# EAGLE schematic allModules (EAGLE 9.6.2)

## Sheet 1 of 7: MAIN MODULE
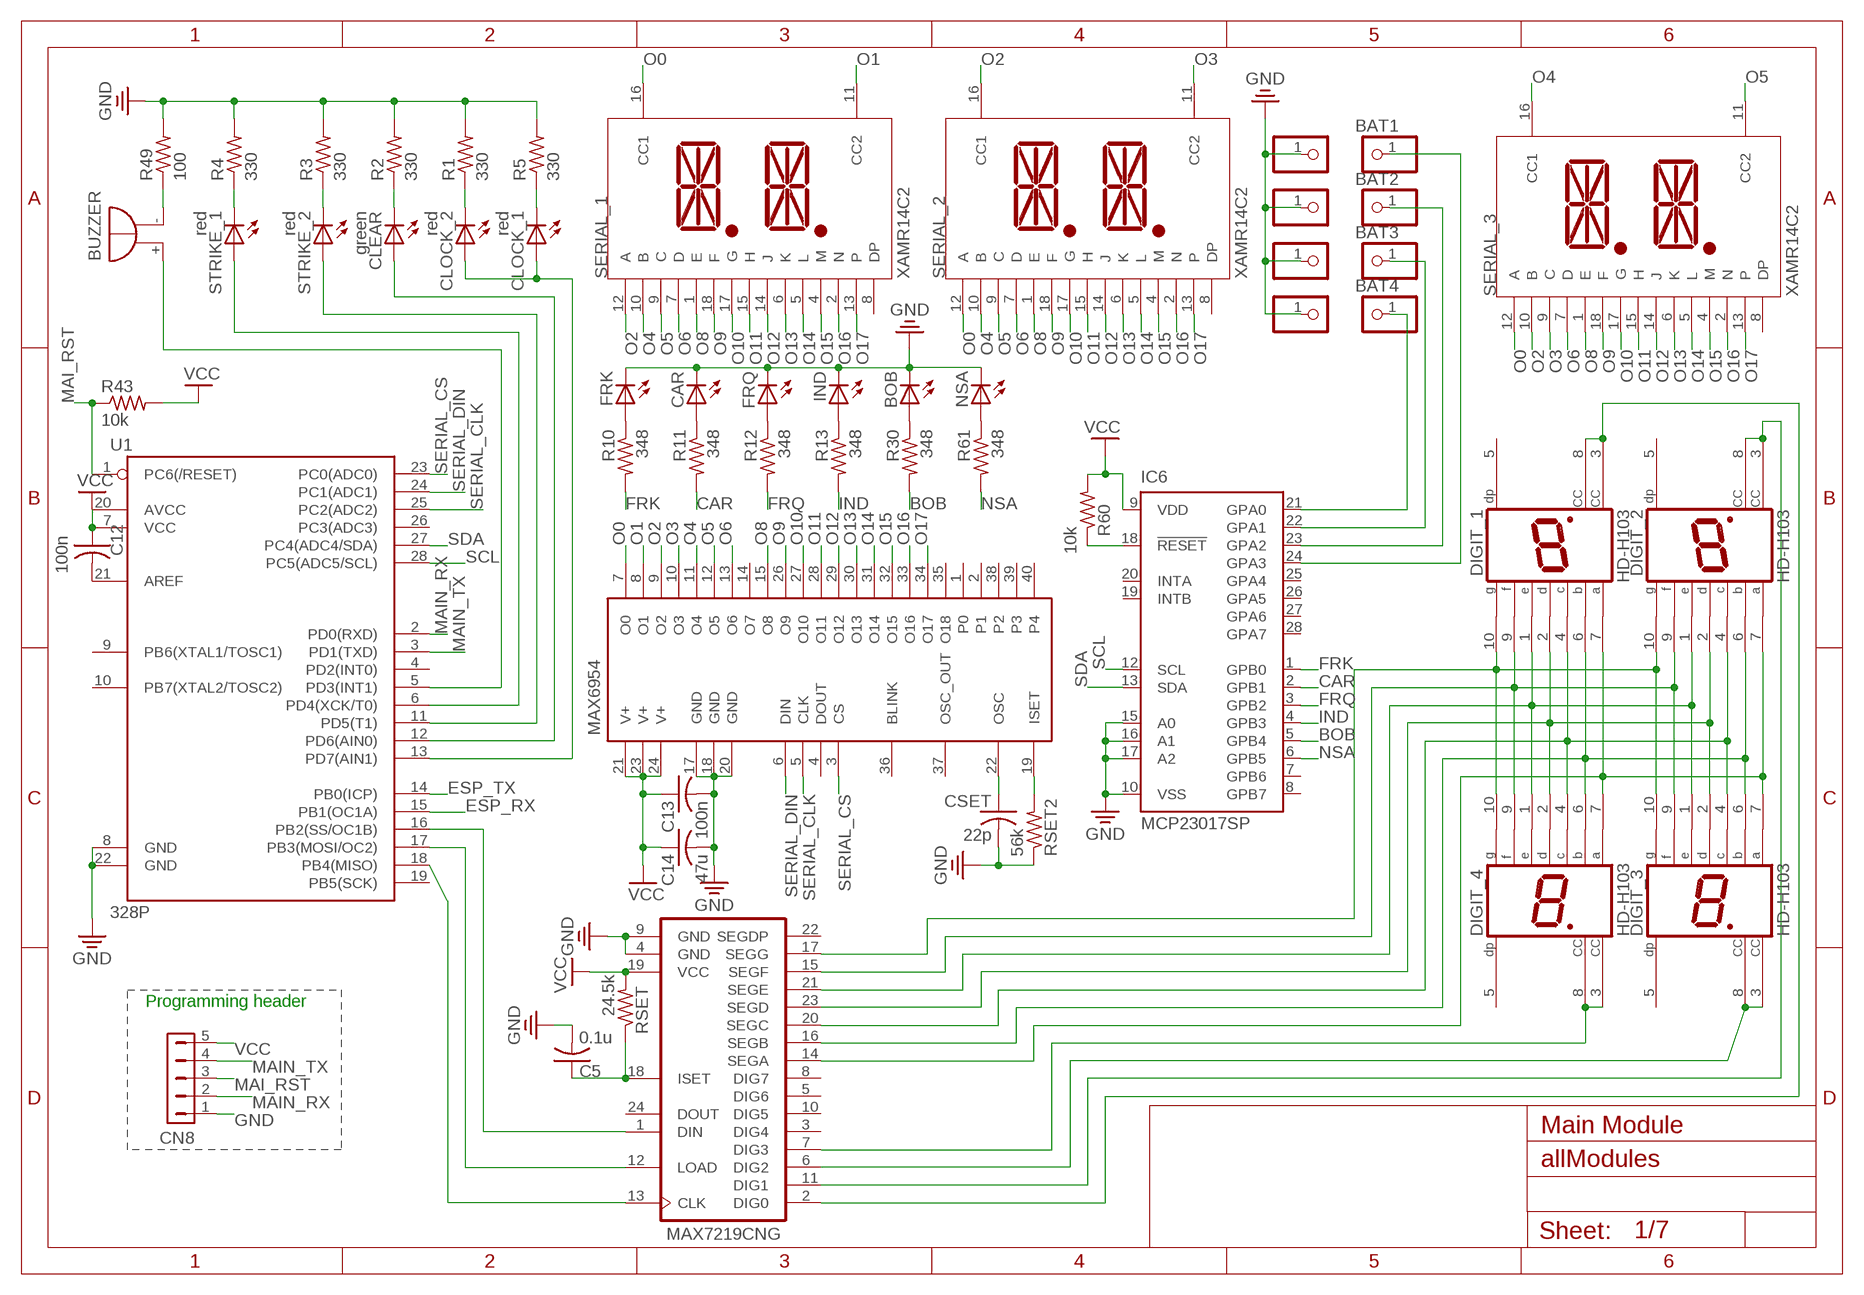
[diagram p0: schematic, sheet 1]

### Parts
BAT1  PINHD-1X1  [1X01]
BAT2  PINHD-1X1  [1X01]
BAT3  PINHD-1X1  [1X01]
BAT4  PINHD-1X1  [1X01]
BOB  LED5MM  [LED5MM]
BUZZER  EB2209A  [EB2209A]
C5  0.1u  C-US025-024X044  [C025-024X044]
C12  100n  C-US025-024X044  [C025-024X044]
C13  100n  C-US025-024X044  [C025-024X044]
C14  47u  C-US025-024X044  [C025-024X044]
CAR  LED5MM  [LED5MM]
CLEAR  green  LED5MM  [LED5MM]
CLOCK_1  red  LED5MM  [LED5MM]
CLOCK_2  red  LED5MM  [LED5MM]
CN8  HDR-1X5-SIP-100  [SIP-100-5V]
CSET  22p  C-US025-024X044  [C025-024X044]
DIGIT_1  HD-H103  [HDSP-M]
DIGIT_2  HD-H103  [HDSP-M]
DIGIT_3  HD-H103  [HDSP-M]
DIGIT_4  HD-H103  [HDSP-M]
FRK  LED5MM  [LED5MM]
FRQ  LED5MM  [LED5MM]
IC1  MAX7219CNG  [DIL24-3]
IC6  MCP23017SP  [DIL28-3]
IND  LED5MM  [LED5MM]
JP17  PINHD-1X1  [1X01]
JP18  PINHD-1X1  [1X01]
JP19  PINHD-1X1  [1X01]
JP20  PINHD-1X1  [1X01]
MAX6954  MAX6954  [MAX6954]
NSA  LED5MM  [LED5MM]
R1  330  R-US_0309/12  [0309/12]
R2  330  R-US_0309/12  [0309/12]
R3  330  R-US_0309/12  [0309/12]
R4  330  R-US_0309/12  [0309/12]
R5  330  R-US_0309/12  [0309/12]
R10  348  R-US_0204/7  [0204/7]
R11  348  R-US_0204/7  [0204/7]
R12  348  R-US_0204/7  [0204/7]
R13  348  R-US_0204/7  [0204/7]
R30  348  R-US_0204/7  [0204/7]
R43  10k  R-US_0309/12  [0309/12]
R49  100  R-US_0309/12  [0309/12]
R60  10k  R-US_0204/7  [0204/7]
R61  348  R-US_0204/7  [0204/7]
RSET  24.5k  R-US_0204/7  [0204/7]
RSET2  56k  R-US_0204/7  [0204/7]
SERIAL_1  XAMR14C2  [XAMR14C2]
SERIAL_2  XAMR14C2  [XAMR14C2]
SERIAL_3  XAMR14C2  [XAMR14C2]
STRIKE_1  red  LED5MM  [LED5MM]
STRIKE_2  red  LED5MM  [LED5MM]
U1  328P  ATMEGA328P_PDIP  [DIP28]

### Nets
BAT1: BAT1.1 IC6.24(GPA3)
BOB: IC6.5(GPB4) R30.2
CAR: IC6.2(GPB1) R11.2
ESP_RX: U1.15(PB1(OC1A)) ; also sheet 2
ESP_TX: U1.14(PB0(ICP)) ; also sheet 2
FRK: IC6.1(GPB0) R10.2
FRQ: IC6.3(GPB2) R12.2
GND: BOB.K(C) C5.2 C13.2 C14.2 CAR.K(C) CN8.1 CSET.2 FRK.K(C) FRQ.K(C) IC1.4(GND) IC1.9(GND) IC6.10(VSS) IC6.15(A0) IC6.16(A1) IC6.17(A2) IND.K(C) JP17.1 JP18.1 JP19.1 JP20.1 MAX6954.17(GND) MAX6954.18(GND) MAX6954.20(GND) NSA.K(C) R1.2 R2.2 R3.2 R4.2 R5.2 R49.2 RSET2.1 U1.8(GND) U1.22(GND) ; also sheet 3,4,5,6,7
IND: IC6.4(GPB3) R13.2
MAI_RST: CN8.3 R43.1 U1.1(PC6(/RESET))
MAIN_RX: CN8.2 U1.2(PD0(RXD))
MAIN_TX: CN8.4 U1.3(PD1(TXD))
N$1: DIGIT_1.7(A) DIGIT_2.7(A) DIGIT_3.7(A) DIGIT_4.7(A) IC1.14(SEGA)
N$2: DIGIT_1.6(B) DIGIT_2.6(B) DIGIT_3.6(B) DIGIT_4.6(B) IC1.16(SEGB)
N$3: DIGIT_1.4(C) DIGIT_2.4(C) DIGIT_3.4(C) DIGIT_4.4(C) IC1.20(SEGC)
N$4: DIGIT_1.2(D) DIGIT_2.2(D) DIGIT_3.2(D) DIGIT_4.2(D) IC1.23(SEGD)
N$5: DIGIT_1.1(E) DIGIT_2.1(E) DIGIT_3.1(E) DIGIT_4.1(E) IC1.21(SEGE)
N$6: DIGIT_1.9(F) DIGIT_2.9(F) DIGIT_3.9(F) DIGIT_4.9(F) IC1.15(SEGF)
N$7: DIGIT_1.10(G) DIGIT_2.10(G) DIGIT_3.10(G) DIGIT_4.10(G) IC1.17(SEGG)
N$8: CSET.1 MAX6954.22(OSC)
N$9: MAX6954.19(ISET) RSET2.2
N$10: IC1.12(LOAD) U1.17(PB3(MOSI/OC2))
N$11: IC1.1(DIN) U1.16(PB2(SS/OC1B))
N$12: IC1.13(CLK) U1.18(PB4(MISO))
N$13: DIGIT_2.3(CC) DIGIT_2.8(CC) IC1.11(DIG1)
N$14: DIGIT_1.3(CC) DIGIT_1.8(CC) IC1.2(DIG0)
N$15: BUZZER.- R49.1
N$18: DIGIT_3.3(CC) DIGIT_3.8(CC) IC1.6(DIG2)
N$19: DIGIT_4.3(CC) DIGIT_4.8(CC) IC1.7(DIG3)
N$22: R4.1 STRIKE_1.K(C)
N$23: R3.1 STRIKE_2.K(C)
N$24: CLEAR.K(C) R2.1
N$25: CLOCK_2.K(C) R1.1
N$26: CLOCK_1.K(C) R5.1
N$28: STRIKE_1.A U1.6(PD4(XCK/T0))
N$29: STRIKE_2.A U1.11(PD5(T1))
N$30: CLEAR.A U1.12(PD6(AIN0))
N$31: CLOCK_1.A CLOCK_2.A U1.13(PD7(AIN1))
N$73: C5.1 IC1.18(ISET) RSET.1
N$108: IC6.18(!RESET) R60.1
N$115: BUZZER.+ U1.5(PD3(INT1))
N$127: FRK.A R10.1
N$128: BAT2.1 IC6.23(GPA2)
N$140: C12.2 U1.21(AREF)
N$141: BAT3.1 IC6.22(GPA1)
N$142: BAT4.1 IC6.21(GPA0)
N$143: CAR.A R11.1
N$146: FRQ.A R12.1
N$147: IND.A R13.1
N$148: BOB.A R30.1
N$151: NSA.A R61.1
NSA: IC6.6(GPB5) R61.2
O0: MAX6954.7(O0) SERIAL_1.16(CC1) SERIAL_2.12(A) SERIAL_3.12(A)
O1: MAX6954.8(O1) SERIAL_1.11(CC2)
O2: MAX6954.9(O2) SERIAL_1.12(A) SERIAL_2.16(CC1) SERIAL_3.10(B)
O3: MAX6954.10(O3) SERIAL_2.11(CC2) SERIAL_3.9(C)
O4: MAX6954.11(O4) SERIAL_1.10(B) SERIAL_2.10(B) SERIAL_3.16(CC1)
O5: MAX6954.12(O5) SERIAL_1.9(C) SERIAL_2.9(C) SERIAL_3.11(CC2)
O6: MAX6954.13(O6) SERIAL_1.7(D) SERIAL_2.7(D) SERIAL_3.7(D)
O8: MAX6954.15(O8) SERIAL_1.1(E) SERIAL_2.1(E) SERIAL_3.1(E)
O9: MAX6954.26(O9) SERIAL_1.18(F) SERIAL_2.18(F) SERIAL_3.18(F)
O10: MAX6954.27(O10) SERIAL_1.17(G) SERIAL_2.17(G) SERIAL_3.17(G)
O11: MAX6954.28(O11) SERIAL_1.15(H) SERIAL_2.15(H) SERIAL_3.15(H)
O12: MAX6954.29(O12) SERIAL_1.14(J) SERIAL_2.14(J) SERIAL_3.14(J)
O13: MAX6954.30(O13) SERIAL_1.6(K) SERIAL_2.6(K) SERIAL_3.6(K)
O14: MAX6954.31(O14) SERIAL_1.5(L) SERIAL_2.5(L) SERIAL_3.5(L)
O15: MAX6954.32(O15) SERIAL_1.4(M) SERIAL_2.4(M) SERIAL_3.4(M)
O16: MAX6954.33(O16) SERIAL_1.2(N) SERIAL_2.2(N) SERIAL_3.2(N)
O17: MAX6954.34(O17) SERIAL_1.13(P) SERIAL_2.13(P) SERIAL_3.13(P)
SCL: IC6.12(SCL) U1.28(PC5(ADC5/SCL)) ; also sheet 3,4,5,6,7
SDA: IC6.13(SDA) U1.27(PC4(ADC4/SDA)) ; also sheet 3,4,5,6,7
SERIAL_CLK: MAX6954.5(CLK) U1.25(PC2(ADC2))
SERIAL_CS: MAX6954.3(CS) U1.23(PC0(ADC0))
SERIAL_DIN: MAX6954.6(DIN) U1.24(PC1(ADC1))
VCC: C12.1 C13.1 C14.1 CN8.5 IC1.19(VCC) IC6.9(VDD) MAX6954.21(V+) MAX6954.23(V+) MAX6954.24(V+) R43.2 R60.2 RSET.2 U1.7(VCC) U1.20(AVCC) ; also sheet 3,4,5,6,7
Unconnected: DIGIT_1.5(DP) DIGIT_2.5(DP) DIGIT_3.5(DP) DIGIT_4.5(DP) IC1.3(DIG4) IC1.5(DIG6) IC1.8(DIG7) IC1.10(DIG5) IC1.22(SEGDP) IC1.24(DOUT) IC6.7(GPB6) IC6.8(GPB7) IC6.19(INTB) IC6.20(INTA) IC6.25(GPA4) IC6.26(GPA5) IC6.27(GPA6) IC6.28(GPA7) MAX6954.1(P0) MAX6954.2(P1) MAX6954.4(DOUT) MAX6954.14(O7) MAX6954.35(O18) MAX6954.36(BLINK) MAX6954.37(OSC_OUT) MAX6954.38(P2) MAX6954.39(P3) MAX6954.40(P4) SERIAL_1.8(DP) SERIAL_2.8(DP) SERIAL_3.8(DP) U1.4(PD2(INT0)) U1.9(PB6(XTAL1/TOSC1)) U1.10(PB7(XTAL2/TOSC2)) U1.19(PB5(SCK)) U1.26(PC3(ADC3))

### Notes on the sheet
- Programming header
- Main Module

## Sheet 2 of 7: CONFIG MODULE
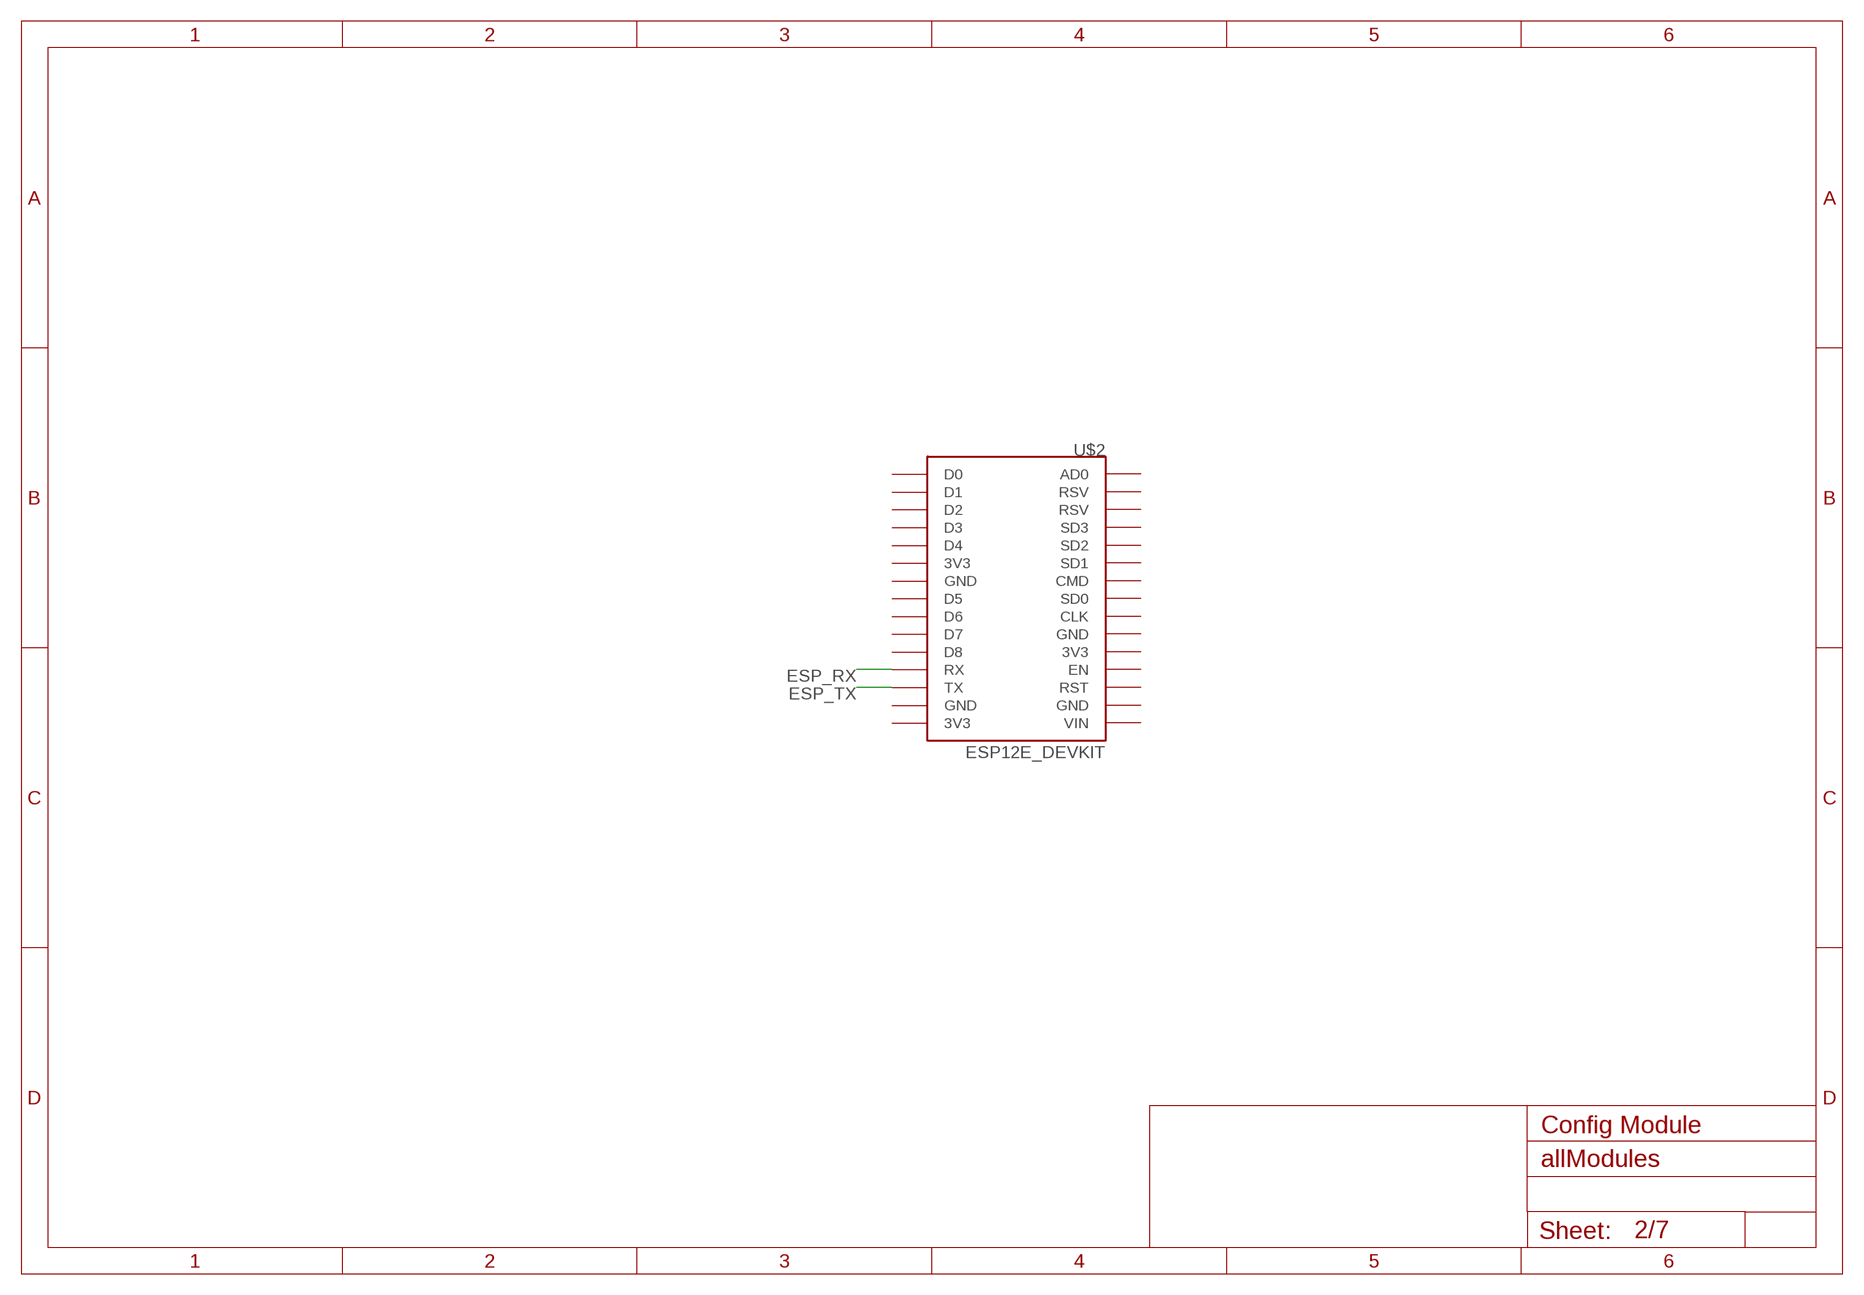
[diagram p1: schematic, sheet 2]

### Parts
U$2  ESP12E_DEVKIT  [ESP12E_DEVKIT]

### Nets
ESP_RX: U$2.RX ; also sheet 1
ESP_TX: U$2.TX ; also sheet 1
Unconnected: U$2.3V3@0(3V3) U$2.3V3@1(3V3) U$2.3V3@2(3V3) U$2.AD0 U$2.CLK U$2.CMD U$2.D0 U$2.D1 U$2.D2 U$2.D3 U$2.D4 U$2.D5 U$2.D6 U$2.D7 U$2.D8 U$2.EN U$2.GND@0(GND) U$2.GND@1(GND) U$2.GND@2(GND) U$2.GND@3(GND) U$2.RST U$2.RSV@0(RSV) U$2.RSV@1(RSV) U$2.SD0 U$2.SD1 U$2.SD2 U$2.SD3 U$2.VIN

### Notes on the sheet
- Config Module

## Sheet 3 of 7: SIMON SAYS
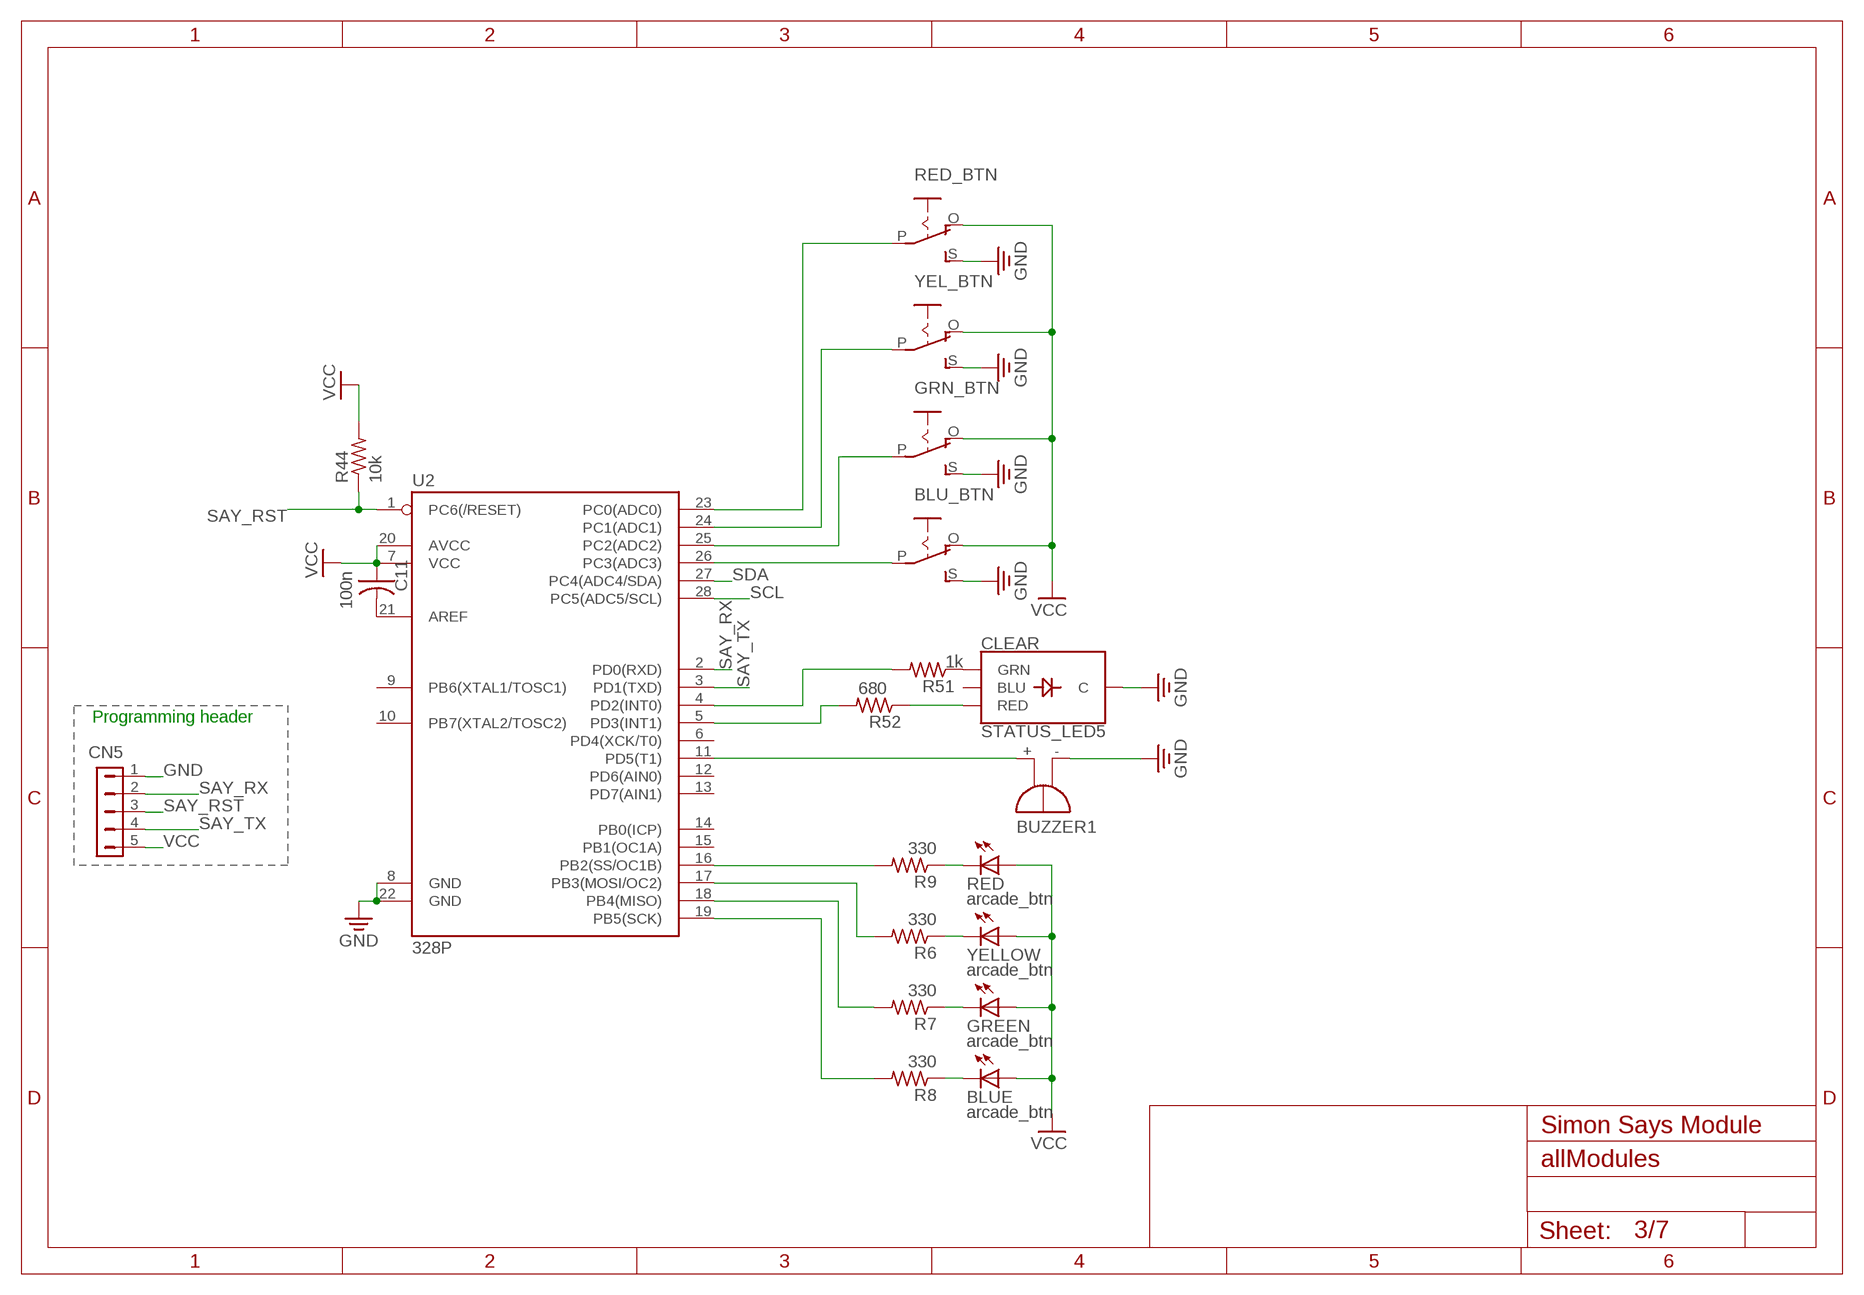
[diagram p2: schematic, sheet 3]

### Parts
BLU_BTN  EG1218S  [EG1218]
BLUE  arcade_btn  LED5MM  [LED5MM]
BUZZER1  EB2209A  [EB2209A]
C11  100n  C-US025-024X044  [C025-024X044]
CN5  HDR-1X5-SIP-100  [SIP-100-5V]
GREEN  arcade_btn  LED5MM  [LED5MM]
GRN_BTN  EG1218S  [EG1218]
R6  330  R-US_0309/12  [0309/12]
R7  330  R-US_0309/12  [0309/12]
R8  330  R-US_0309/12  [0309/12]
R9  330  R-US_0309/12  [0309/12]
R44  10k  R-US_0309/12  [0309/12]
R51  1k  FLIPFLOP-RES  [0805-THM]
R52  680  FLIPFLOP-RES  [0805-THM]
RED  arcade_btn  LED5MM  [LED5MM]
RED_BTN  EG1218S  [EG1218]
STATUS_LED5  CLEAR  LED-RGB-CCCLEAR  [LED-RGB-THRU]
U2  328P  ATMEGA328P_PDIP  [DIP28]
YEL_BTN  EG1218S  [EG1218]
YELLOW  arcade_btn  LED5MM  [LED5MM]

### Nets
GND: BLU_BTN.S BUZZER1.- CN5.1 GRN_BTN.S RED_BTN.S STATUS_LED5.2(C) U2.8(GND) U2.22(GND) YEL_BTN.S ; also sheet 1,4,5,6,7
N$33: BUZZER1.+ U2.11(PD5(T1))
N$34: BLU_BTN.P U2.26(PC3(ADC3))
N$35: GRN_BTN.P U2.25(PC2(ADC2))
N$38: U2.24(PC1(ADC1)) YEL_BTN.P
N$39: RED_BTN.P U2.23(PC0(ADC0))
N$43: R6.2 U2.17(PB3(MOSI/OC2))
N$44: BLUE.K(C) R8.1
N$45: GREEN.K(C) R7.1
N$46: R6.1 YELLOW.K(C)
N$47: R9.1 RED.K(C)
N$48: R7.2 R8.2 U2.18(PB4(MISO)) U2.19(PB5(SCK))
N$70: R52.2 U2.5(PD3(INT1))
N$71: R51.2 U2.4(PD2(INT0))
N$116: R9.2 U2.16(PB2(SS/OC1B))
N$139: C11.2 U2.21(AREF)
N$144: R51.1 STATUS_LED5.3(GRN)
N$145: R52.1 STATUS_LED5.1(RED)
SAY_RST: CN5.3 R44.1 U2.1(PC6(/RESET))
SAY_RX: CN5.2 U2.2(PD0(RXD))
SAY_TX: CN5.4 U2.3(PD1(TXD))
SCL: U2.28(PC5(ADC5/SCL)) ; also sheet 1,4,5,6,7
SDA: U2.27(PC4(ADC4/SDA)) ; also sheet 1,4,5,6,7
VCC: BLU_BTN.O BLUE.A C11.1 CN5.5 GREEN.A GRN_BTN.O R44.2 RED.A RED_BTN.O U2.7(VCC) U2.20(AVCC) YEL_BTN.O YELLOW.A ; also sheet 1,4,5,6,7
Unconnected: STATUS_LED5.4(BLU) U2.6(PD4(XCK/T0)) U2.9(PB6(XTAL1/TOSC1)) U2.10(PB7(XTAL2/TOSC2)) U2.12(PD6(AIN0)) U2.13(PD7(AIN1)) U2.14(PB0(ICP)) U2.15(PB1(OC1A))

### Notes on the sheet
- Programming header
- Simon Says Module

## Sheet 4 of 7: MAZE
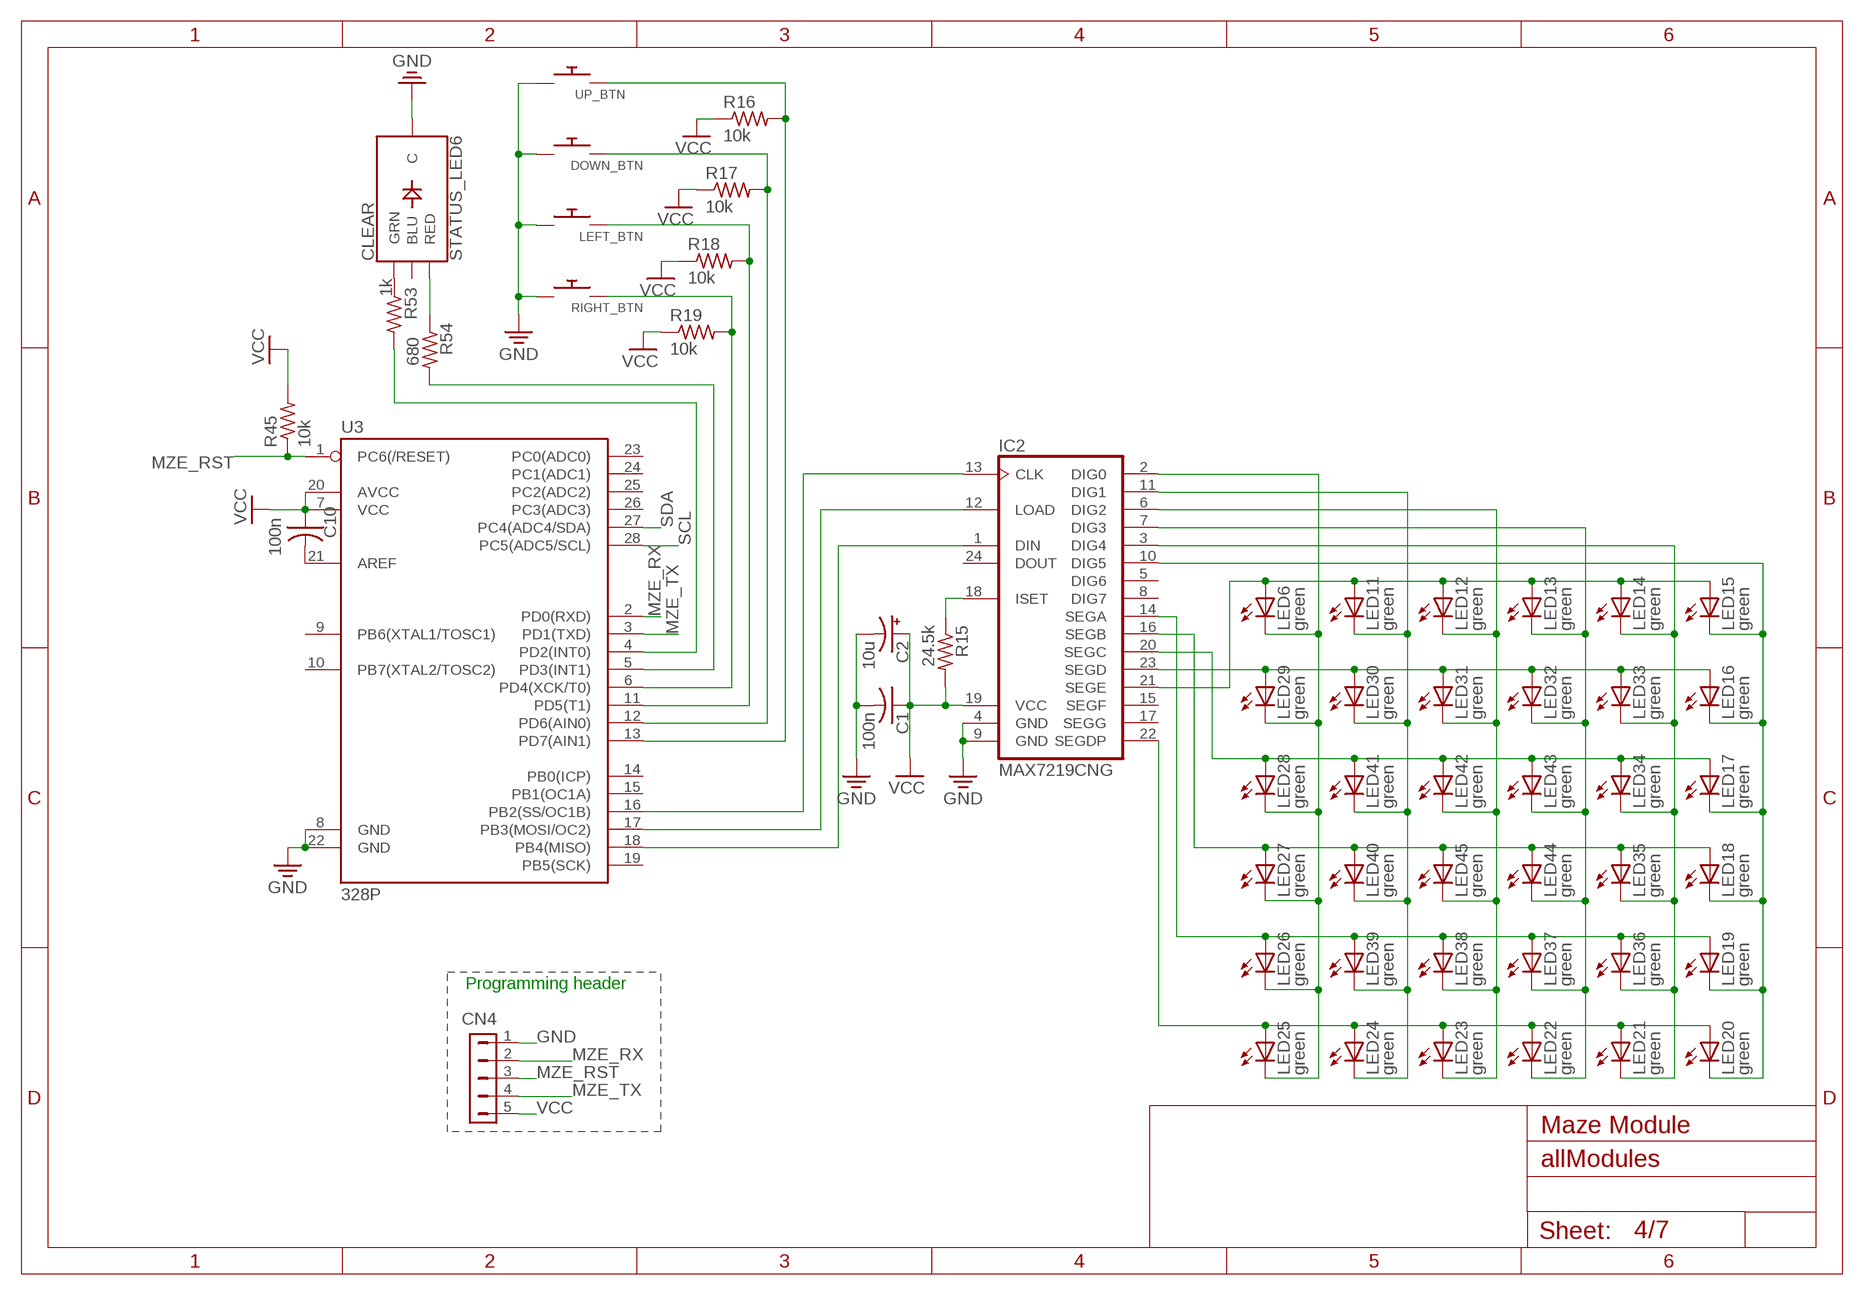
[diagram p3: schematic, sheet 4]

### Parts
C1  100n  C-US025-024X044  [C025-024X044]
C2  10u  CPOL-US085CS-1AR  [085CS_1AR]
C10  100n  C-US025-024X044  [C025-024X044]
CN4  HDR-1X5-SIP-100  [SIP-100-5V]
DOWN_BTN  SWITCH_PUSHBUTTONEVQ-PE  [TACT_PANA-EVQ]
IC2  MAX7219CNG  [DIL24-3]
LED6  green  LED5MM  [LED5MM]
LED11  green  LED5MM  [LED5MM]
LED12  green  LED5MM  [LED5MM]
LED13  green  LED5MM  [LED5MM]
LED14  green  LED5MM  [LED5MM]
LED15  green  LED5MM  [LED5MM]
LED16  green  LED5MM  [LED5MM]
LED17  green  LED5MM  [LED5MM]
LED18  green  LED5MM  [LED5MM]
LED19  green  LED5MM  [LED5MM]
LED20  green  LED5MM  [LED5MM]
LED21  green  LED5MM  [LED5MM]
LED22  green  LED5MM  [LED5MM]
LED23  green  LED5MM  [LED5MM]
LED24  green  LED5MM  [LED5MM]
LED25  green  LED5MM  [LED5MM]
LED26  green  LED5MM  [LED5MM]
LED27  green  LED5MM  [LED5MM]
LED28  green  LED5MM  [LED5MM]
LED29  green  LED5MM  [LED5MM]
LED30  green  LED5MM  [LED5MM]
LED31  green  LED5MM  [LED5MM]
LED32  green  LED5MM  [LED5MM]
LED33  green  LED5MM  [LED5MM]
LED34  green  LED5MM  [LED5MM]
LED35  green  LED5MM  [LED5MM]
LED36  green  LED5MM  [LED5MM]
LED37  green  LED5MM  [LED5MM]
LED38  green  LED5MM  [LED5MM]
LED39  green  LED5MM  [LED5MM]
LED40  green  LED5MM  [LED5MM]
LED41  green  LED5MM  [LED5MM]
LED42  green  LED5MM  [LED5MM]
LED43  green  LED5MM  [LED5MM]
LED44  green  LED5MM  [LED5MM]
LED45  green  LED5MM  [LED5MM]
LEFT_BTN  SWITCH_PUSHBUTTONEVQ-PE  [TACT_PANA-EVQ]
R15  24.5k  R-US_0309/12  [0309/12]
R16  10k  R-US_0309/12  [0309/12]
R17  10k  R-US_0309/12  [0309/12]
R18  10k  R-US_0309/12  [0309/12]
R19  10k  R-US_0309/12  [0309/12]
R45  10k  R-US_0309/12  [0309/12]
R53  1k  FLIPFLOP-RES  [0805-THM]
R54  680  FLIPFLOP-RES  [0805-THM]
RIGHT_BTN  SWITCH_PUSHBUTTONEVQ-PE  [TACT_PANA-EVQ]
STATUS_LED6  CLEAR  LED-RGB-CCCLEAR  [LED-RGB-THRU]
U3  328P  ATMEGA328P_PDIP  [DIP28]
UP_BTN  SWITCH_PUSHBUTTONEVQ-PE  [TACT_PANA-EVQ]

### Nets
GND: C1.2 C2.- CN4.1 DOWN_BTN.P$1 IC2.4(GND) IC2.9(GND) LEFT_BTN.P$1 RIGHT_BTN.P$1 STATUS_LED6.2(C) U3.8(GND) U3.22(GND) UP_BTN.P$1 ; also sheet 1,3,5,6,7
MZE_RST: CN4.3 R45.1 U3.1(PC6(/RESET))
MZE_RX: CN4.2 U3.2(PD0(RXD))
MZE_TX: CN4.4 U3.3(PD1(TXD))
N$36: IC2.22(SEGDP) LED20.A LED21.A LED22.A LED23.A LED24.A LED25.A
N$40: IC2.14(SEGA) LED19.A LED26.A LED36.A LED37.A LED38.A LED39.A
N$41: IC2.16(SEGB) LED18.A LED27.A LED35.A LED40.A LED44.A LED45.A
N$42: IC2.20(SEGC) LED17.A LED28.A LED34.A LED41.A LED42.A LED43.A
N$49: IC2.2(DIG0) LED6.K(C) LED25.K(C) LED26.K(C) LED27.K(C) LED28.K(C) LED29.K(C)
N$50: IC2.21(SEGE) LED11.A LED12.A LED13.A LED14.A LED15.A
N$52: IC2.23(SEGD) LED16.A LED29.A LED30.A LED31.A LED32.A LED33.A
N$53: R16.2 U3.13(PD7(AIN1)) UP_BTN.P$2
N$54: IC2.11(DIG1) LED11.K(C) LED24.K(C) LED30.K(C) LED39.K(C) LED40.K(C) LED41.K(C)
N$55: IC2.6(DIG2) LED12.K(C) LED23.K(C) LED31.K(C) LED38.K(C) LED42.K(C) LED45.K(C)
N$56: IC2.7(DIG3) LED13.K(C) LED22.K(C) LED32.K(C) LED37.K(C) LED43.K(C) LED44.K(C)
N$57: IC2.3(DIG4) LED14.K(C) LED21.K(C) LED33.K(C) LED34.K(C) LED35.K(C) LED36.K(C)
N$58: IC2.10(DIG5) LED15.K(C) LED16.K(C) LED17.K(C) LED18.K(C) LED19.K(C) LED20.K(C)
N$59: DOWN_BTN.P$2 R17.2 U3.12(PD6(AIN0))
N$60: LEFT_BTN.P$2 R18.2 U3.11(PD5(T1))
N$61: IC2.18(ISET) R15.1
N$62: R19.2 RIGHT_BTN.P$2 U3.6(PD4(XCK/T0))
N$63: IC2.1(DIN) U3.18(PB4(MISO))
N$64: IC2.13(CLK) U3.16(PB2(SS/OC1B))
N$65: IC2.12(LOAD) U3.17(PB3(MOSI/OC2))
N$67: R54.2 U3.5(PD3(INT1))
N$68: R53.2 U3.4(PD2(INT0))
N$138: C10.2 U3.21(AREF)
N$149: R53.1 STATUS_LED6.3(GRN)
N$150: R54.1 STATUS_LED6.1(RED)
SCL: U3.28(PC5(ADC5/SCL)) ; also sheet 1,3,5,6,7
SDA: U3.27(PC4(ADC4/SDA)) ; also sheet 1,3,5,6,7
VCC: C1.1 C2.+ C10.1 CN4.5 IC2.19(VCC) R15.2 R16.1 R17.1 R18.1 R19.1 R45.2 U3.7(VCC) U3.20(AVCC) ; also sheet 1,3,5,6,7
VCC2: LED6.A
Unconnected: IC2.5(DIG6) IC2.8(DIG7) IC2.15(SEGF) IC2.17(SEGG) IC2.24(DOUT) STATUS_LED6.4(BLU) U3.9(PB6(XTAL1/TOSC1)) U3.10(PB7(XTAL2/TOSC2)) U3.14(PB0(ICP)) U3.15(PB1(OC1A)) U3.19(PB5(SCK)) U3.23(PC0(ADC0)) U3.24(PC1(ADC1)) U3.25(PC2(ADC2)) U3.26(PC3(ADC3))

### Notes on the sheet
- Programming header
- Maze Module

## Sheet 5 of 7: SIMPLE WIRES
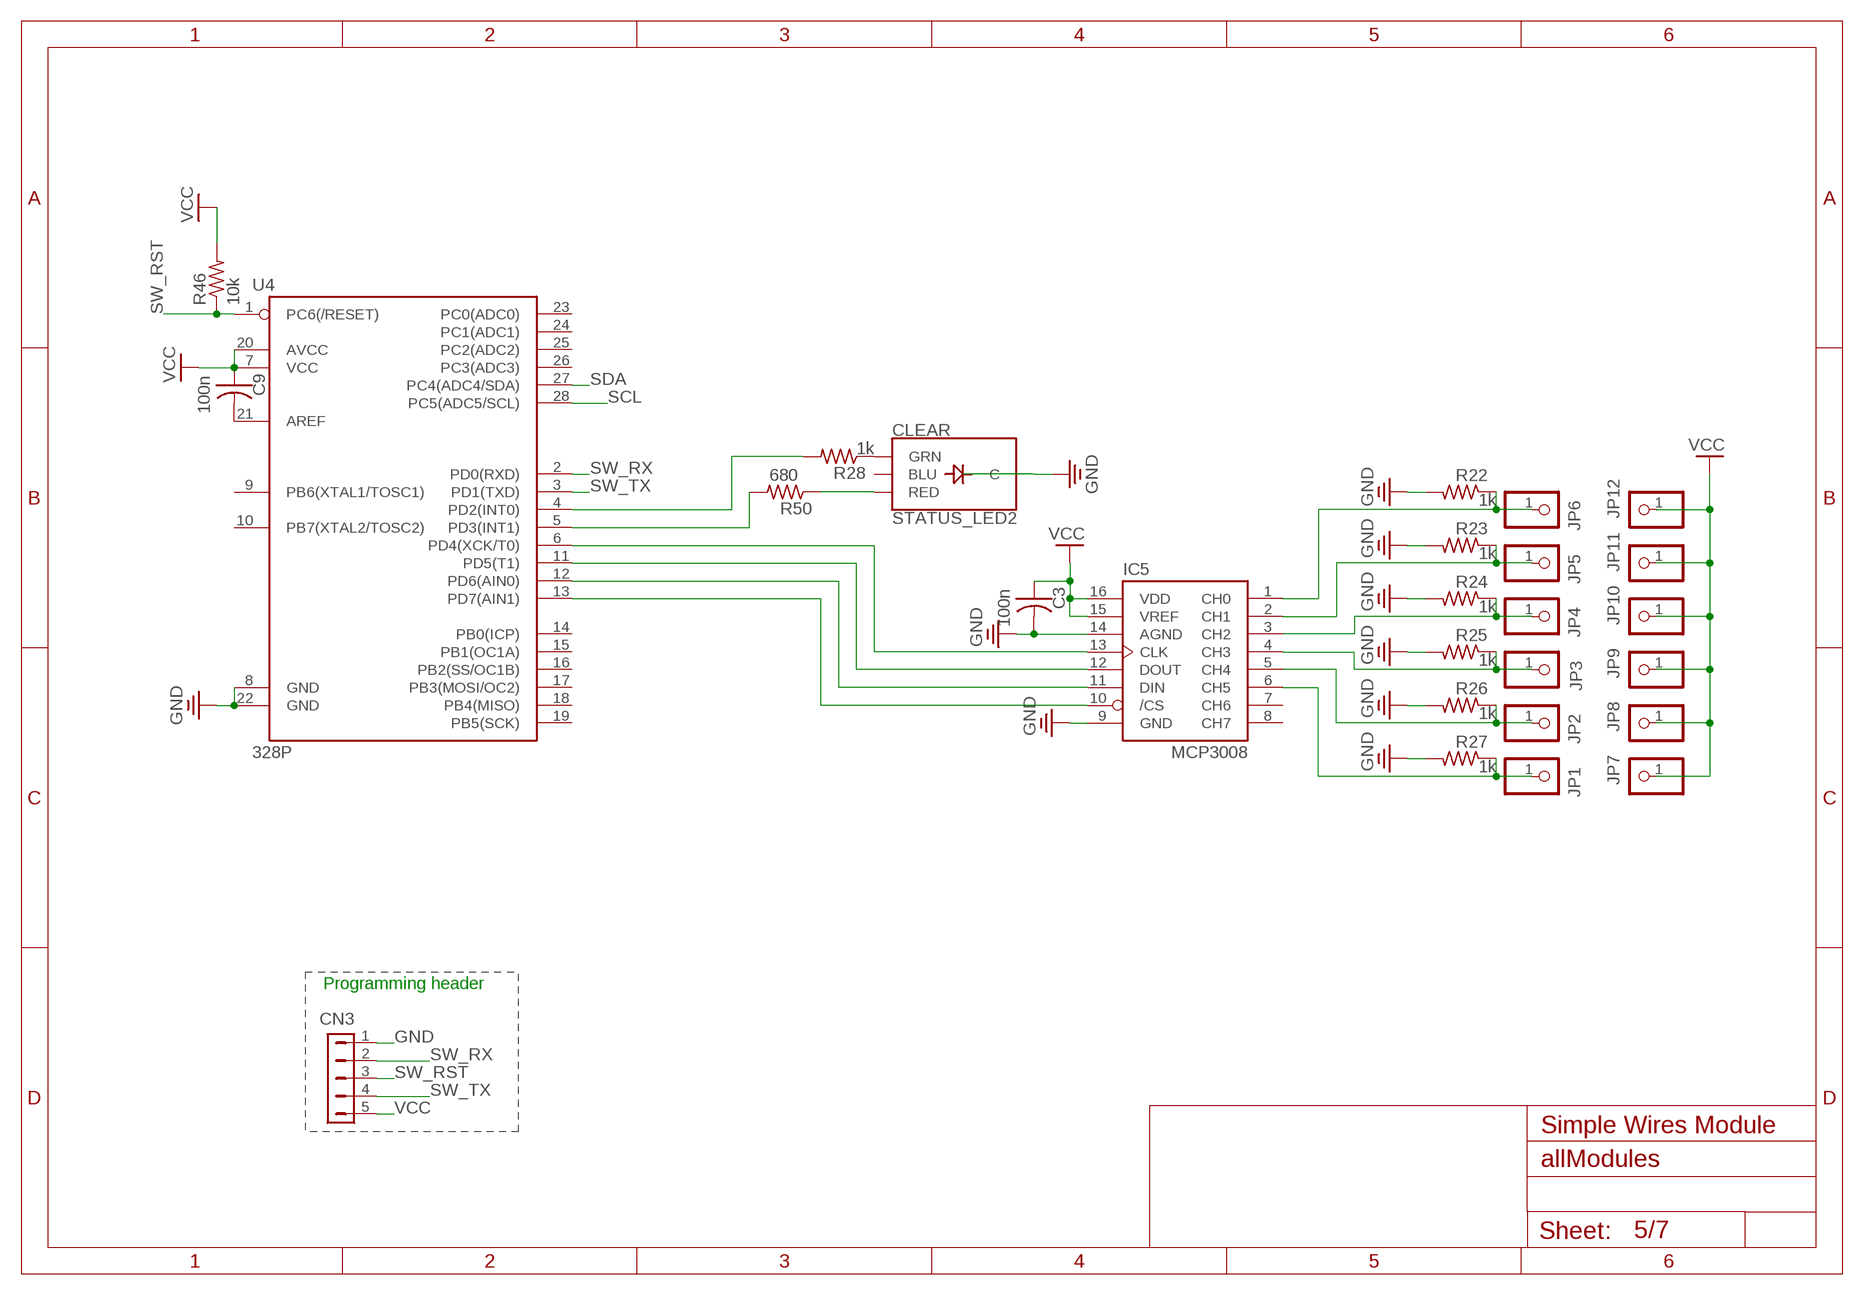
[diagram p4: schematic, sheet 5]

### Parts
C3  100n  C-US025-024X044  [C025-024X044]
C9  100n  C-US025-024X044  [C025-024X044]
CN3  HDR-1X5-SIP-100  [SIP-100-5V]
IC5  MCP3008  [DIL16]
JP1  PINHD-1X1  [1X01]
JP2  PINHD-1X1  [1X01]
JP3  PINHD-1X1  [1X01]
JP4  PINHD-1X1  [1X01]
JP5  PINHD-1X1  [1X01]
JP6  PINHD-1X1  [1X01]
JP7  PINHD-1X1  [1X01]
JP8  PINHD-1X1  [1X01]
JP9  PINHD-1X1  [1X01]
JP10  PINHD-1X1  [1X01]
JP11  PINHD-1X1  [1X01]
JP12  PINHD-1X1  [1X01]
R22  1k  FLIPFLOP-RES  [0805-THM]
R23  1k  FLIPFLOP-RES  [0805-THM]
R24  1k  FLIPFLOP-RES  [0805-THM]
R25  1k  FLIPFLOP-RES  [0805-THM]
R26  1k  FLIPFLOP-RES  [0805-THM]
R27  1k  FLIPFLOP-RES  [0805-THM]
R28  1k  FLIPFLOP-RES  [0805-THM]
R46  10k  R-US_0309/12  [0309/12]
R50  680  FLIPFLOP-RES  [0805-THM]
STATUS_LED2  CLEAR  LED-RGB-CCCLEAR  [LED-RGB-THRU]
U4  328P  ATMEGA328P_PDIP  [DIP28]

### Nets
GND: C3.2 CN3.1 IC5.9(GND) IC5.14(AGND) R22.2 R23.2 R24.2 R25.2 R26.2 R27.2 U4.8(GND) U4.22(GND) ; also sheet 1,3,4,6,7
N$16: R28.1 STATUS_LED2.3(GRN)
N$20: IC5.1(CH0) JP6.1 R22.1
N$21: STATUS_LED2.2(C) ; supply symbol labelled GND
N$27: IC5.6(CH5) JP1.1 R27.1
N$32: R50.1 STATUS_LED2.1(RED)
N$37: IC5.5(CH4) JP2.1 R26.1
N$51: IC5.4(CH3) JP3.1 R25.1
N$66: IC5.3(CH2) JP4.1 R24.1
N$74: IC5.2(CH1) JP5.1 R23.1
N$75: R28.2 U4.4(PD2(INT0))
N$76: R50.2 U4.5(PD3(INT1))
N$86: IC5.13(CLK) U4.6(PD4(XCK/T0))
N$87: IC5.12(DOUT) U4.11(PD5(T1))
N$88: IC5.11(DIN) U4.12(PD6(AIN0))
N$90: IC5.10(/CS) U4.13(PD7(AIN1))
N$124: C9.2 U4.21(AREF)
SCL: U4.28(PC5(ADC5/SCL)) ; also sheet 1,3,4,6,7
SDA: U4.27(PC4(ADC4/SDA)) ; also sheet 1,3,4,6,7
SW_RST: CN3.3 R46.1 U4.1(PC6(/RESET))
SW_RX: CN3.2 U4.2(PD0(RXD))
SW_TX: CN3.4 U4.3(PD1(TXD))
VCC: C3.1 C9.1 CN3.5 IC5.15(VREF) IC5.16(VDD) JP7.1 JP8.1 JP9.1 JP10.1 JP11.1 JP12.1 R46.2 U4.7(VCC) U4.20(AVCC) ; also sheet 1,3,4,6,7
Unconnected: IC5.7(CH6) IC5.8(CH7) STATUS_LED2.4(BLU) U4.9(PB6(XTAL1/TOSC1)) U4.10(PB7(XTAL2/TOSC2)) U4.14(PB0(ICP)) U4.15(PB1(OC1A)) U4.16(PB2(SS/OC1B)) U4.17(PB3(MOSI/OC2)) U4.18(PB4(MISO)) U4.19(PB5(SCK)) U4.23(PC0(ADC0)) U4.24(PC1(ADC1)) U4.25(PC2(ADC2)) U4.26(PC3(ADC3))

### Notes on the sheet
- Programming header
- Simple Wires Module

## Sheet 6 of 7: BUTTON
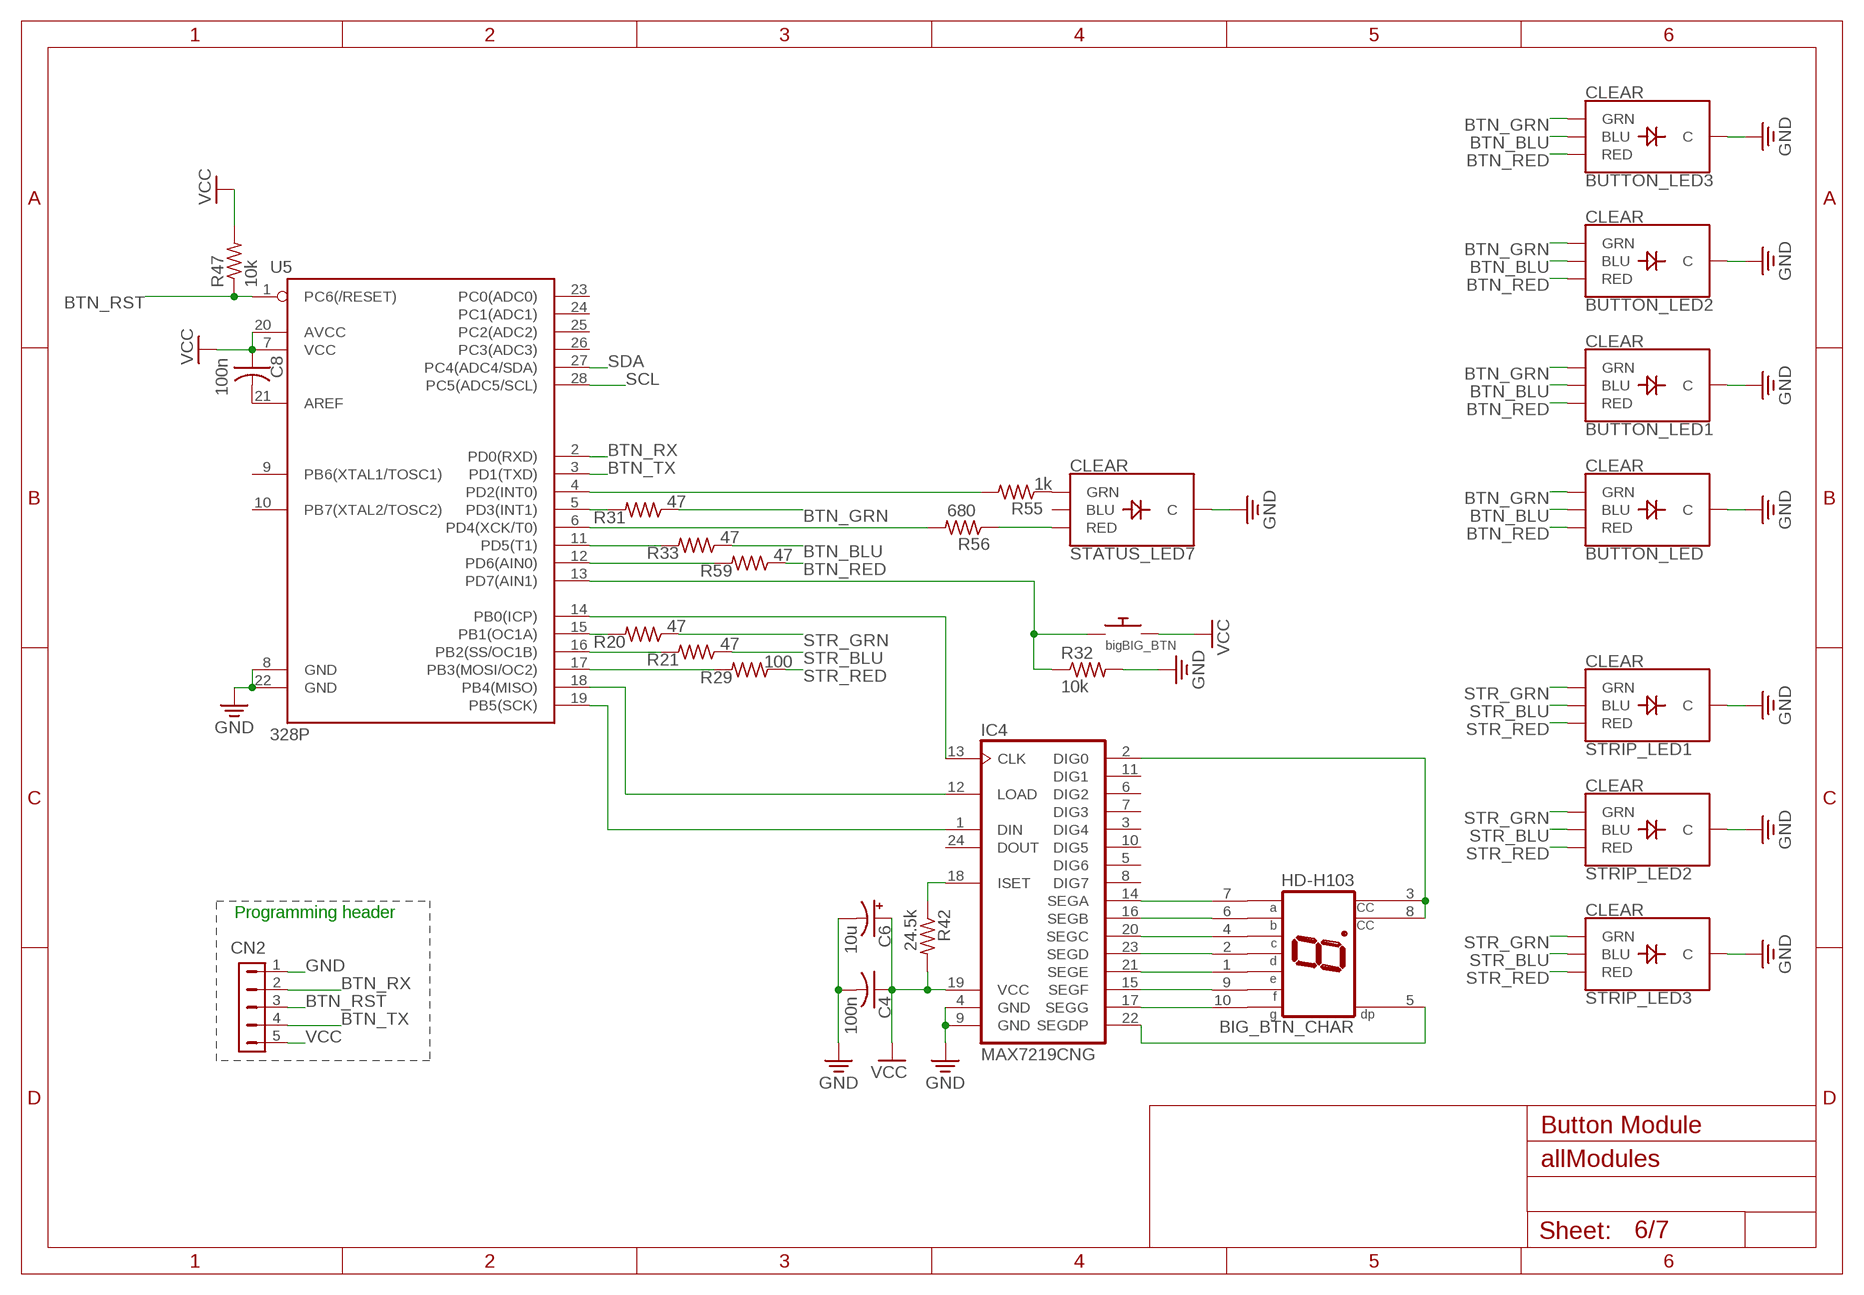
[diagram p5: schematic, sheet 6]

### Parts
BIG_BTN  big  SWITCH_PUSHBUTTONEVQ-PE  [TACT_PANA-EVQ]
BIG_BTN_CHAR  HD-H103  [HDSP-M]
BUTTON_LED  CLEAR  LED-RGB-CCCLEAR  [LED-RGB-THRU]
BUTTON_LED1  CLEAR  LED-RGB-CCCLEAR  [LED-RGB-THRU]
BUTTON_LED2  CLEAR  LED-RGB-CCCLEAR  [LED-RGB-THRU]
BUTTON_LED3  CLEAR  LED-RGB-CCCLEAR  [LED-RGB-THRU]
C4  100n  C-US025-024X044  [C025-024X044]
C6  10u  CPOL-US085CS-1AR  [085CS_1AR]
C8  100n  C-US025-024X044  [C025-024X044]
CN2  HDR-1X5-SIP-100  [SIP-100-5V]
IC4  MAX7219CNG  [DIL24-3]
R20  47  FLIPFLOP-RES  [0805-THM]
R21  47  FLIPFLOP-RES  [0805-THM]
R29  100  FLIPFLOP-RES  [0805-THM]
R31  47  FLIPFLOP-RES  [0805-THM]
R32  10k  R-US_0309/12  [0309/12]
R33  47  FLIPFLOP-RES  [0805-THM]
R42  24.5k  R-US_0309/12  [0309/12]
R47  10k  R-US_0309/12  [0309/12]
R55  1k  FLIPFLOP-RES  [0805-THM]
R56  680  FLIPFLOP-RES  [0805-THM]
R59  47  FLIPFLOP-RES  [0805-THM]
STATUS_LED7  CLEAR  LED-RGB-CCCLEAR  [LED-RGB-THRU]
STRIP_LED1  CLEAR  LED-RGB-CCCLEAR  [LED-RGB-THRU]
STRIP_LED2  CLEAR  LED-RGB-CCCLEAR  [LED-RGB-THRU]
STRIP_LED3  CLEAR  LED-RGB-CCCLEAR  [LED-RGB-THRU]
U5  328P  ATMEGA328P_PDIP  [DIP28]

### Nets
BTN_BLU: BUTTON_LED1.4(BLU) BUTTON_LED2.4(BLU) BUTTON_LED3.4(BLU) BUTTON_LED.4(BLU) R33.1
BTN_GRN: BUTTON_LED1.3(GRN) BUTTON_LED2.3(GRN) BUTTON_LED3.3(GRN) BUTTON_LED.3(GRN) R31.1
BTN_RED: BUTTON_LED1.1(RED) BUTTON_LED2.1(RED) BUTTON_LED3.1(RED) BUTTON_LED.1(RED) R59.1
BTN_RST: CN2.3 R47.1 U5.1(PC6(/RESET))
BTN_RX: CN2.2 U5.2(PD0(RXD))
BTN_TX: CN2.4 U5.3(PD1(TXD))
GND: BUTTON_LED1.2(C) BUTTON_LED2.2(C) BUTTON_LED3.2(C) BUTTON_LED.2(C) C4.2 C6.- CN2.1 IC4.4(GND) IC4.9(GND) R32.2 STATUS_LED7.2(C) STRIP_LED1.2(C) STRIP_LED2.2(C) STRIP_LED3.2(C) U5.8(GND) U5.22(GND) ; also sheet 1,3,4,5,7
N$17: R20.2 U5.15(PB1(OC1A))
N$69: R21.2 U5.16(PB2(SS/OC1B))
N$72: R29.2 U5.17(PB3(MOSI/OC2))
N$77: R31.2 U5.5(PD3(INT1))
N$78: R33.2 U5.11(PD5(T1))
N$79: R59.2 U5.12(PD6(AIN0))
N$80: R55.2 U5.4(PD2(INT0))
N$81: BIG_BTN.P$1 R32.1 U5.13(PD7(AIN1))
N$82: BIG_BTN_CHAR.7(A) IC4.14(SEGA)
N$83: R56.2 U5.6(PD4(XCK/T0))
N$84: BIG_BTN_CHAR.6(B) IC4.16(SEGB)
N$85: IC4.13(CLK) U5.14(PB0(ICP))
N$89: BIG_BTN_CHAR.4(C) IC4.20(SEGC)
N$109: C8.2 U5.21(AREF)
N$122: IC4.18(ISET) R42.1
N$123: IC4.1(DIN) U5.19(PB5(SCK))
N$125: IC4.12(LOAD) U5.18(PB4(MISO))
N$126: BIG_BTN_CHAR.2(D) IC4.23(SEGD)
N$129: BIG_BTN_CHAR.1(E) IC4.21(SEGE)
N$130: BIG_BTN_CHAR.9(F) IC4.15(SEGF)
N$131: BIG_BTN_CHAR.10(G) IC4.17(SEGG)
N$132: BIG_BTN_CHAR.5(DP) IC4.22(SEGDP)
N$133: BIG_BTN_CHAR.3(CC) BIG_BTN_CHAR.8(CC) IC4.2(DIG0)
N$154: R55.1 STATUS_LED7.3(GRN)
N$155: R56.1 STATUS_LED7.1(RED)
SCL: U5.28(PC5(ADC5/SCL)) ; also sheet 1,3,4,5,7
SDA: U5.27(PC4(ADC4/SDA)) ; also sheet 1,3,4,5,7
STR_BLU: R21.1 STRIP_LED1.4(BLU) STRIP_LED2.4(BLU) STRIP_LED3.4(BLU)
STR_GRN: R20.1 STRIP_LED1.3(GRN) STRIP_LED2.3(GRN) STRIP_LED3.3(GRN)
STR_RED: R29.1 STRIP_LED1.1(RED) STRIP_LED2.1(RED) STRIP_LED3.1(RED)
VCC: BIG_BTN.P$2 C4.1 C6.+ C8.1 CN2.5 IC4.19(VCC) R42.2 R47.2 U5.7(VCC) U5.20(AVCC) ; also sheet 1,3,4,5,7
Unconnected: IC4.3(DIG4) IC4.5(DIG6) IC4.6(DIG2) IC4.7(DIG3) IC4.8(DIG7) IC4.10(DIG5) IC4.11(DIG1) IC4.24(DOUT) STATUS_LED7.4(BLU) U5.9(PB6(XTAL1/TOSC1)) U5.10(PB7(XTAL2/TOSC2)) U5.23(PC0(ADC0)) U5.24(PC1(ADC1)) U5.25(PC2(ADC2)) U5.26(PC3(ADC3))

### Notes on the sheet
- Programming header
- Button Module

## Sheet 7 of 7: MEMORY
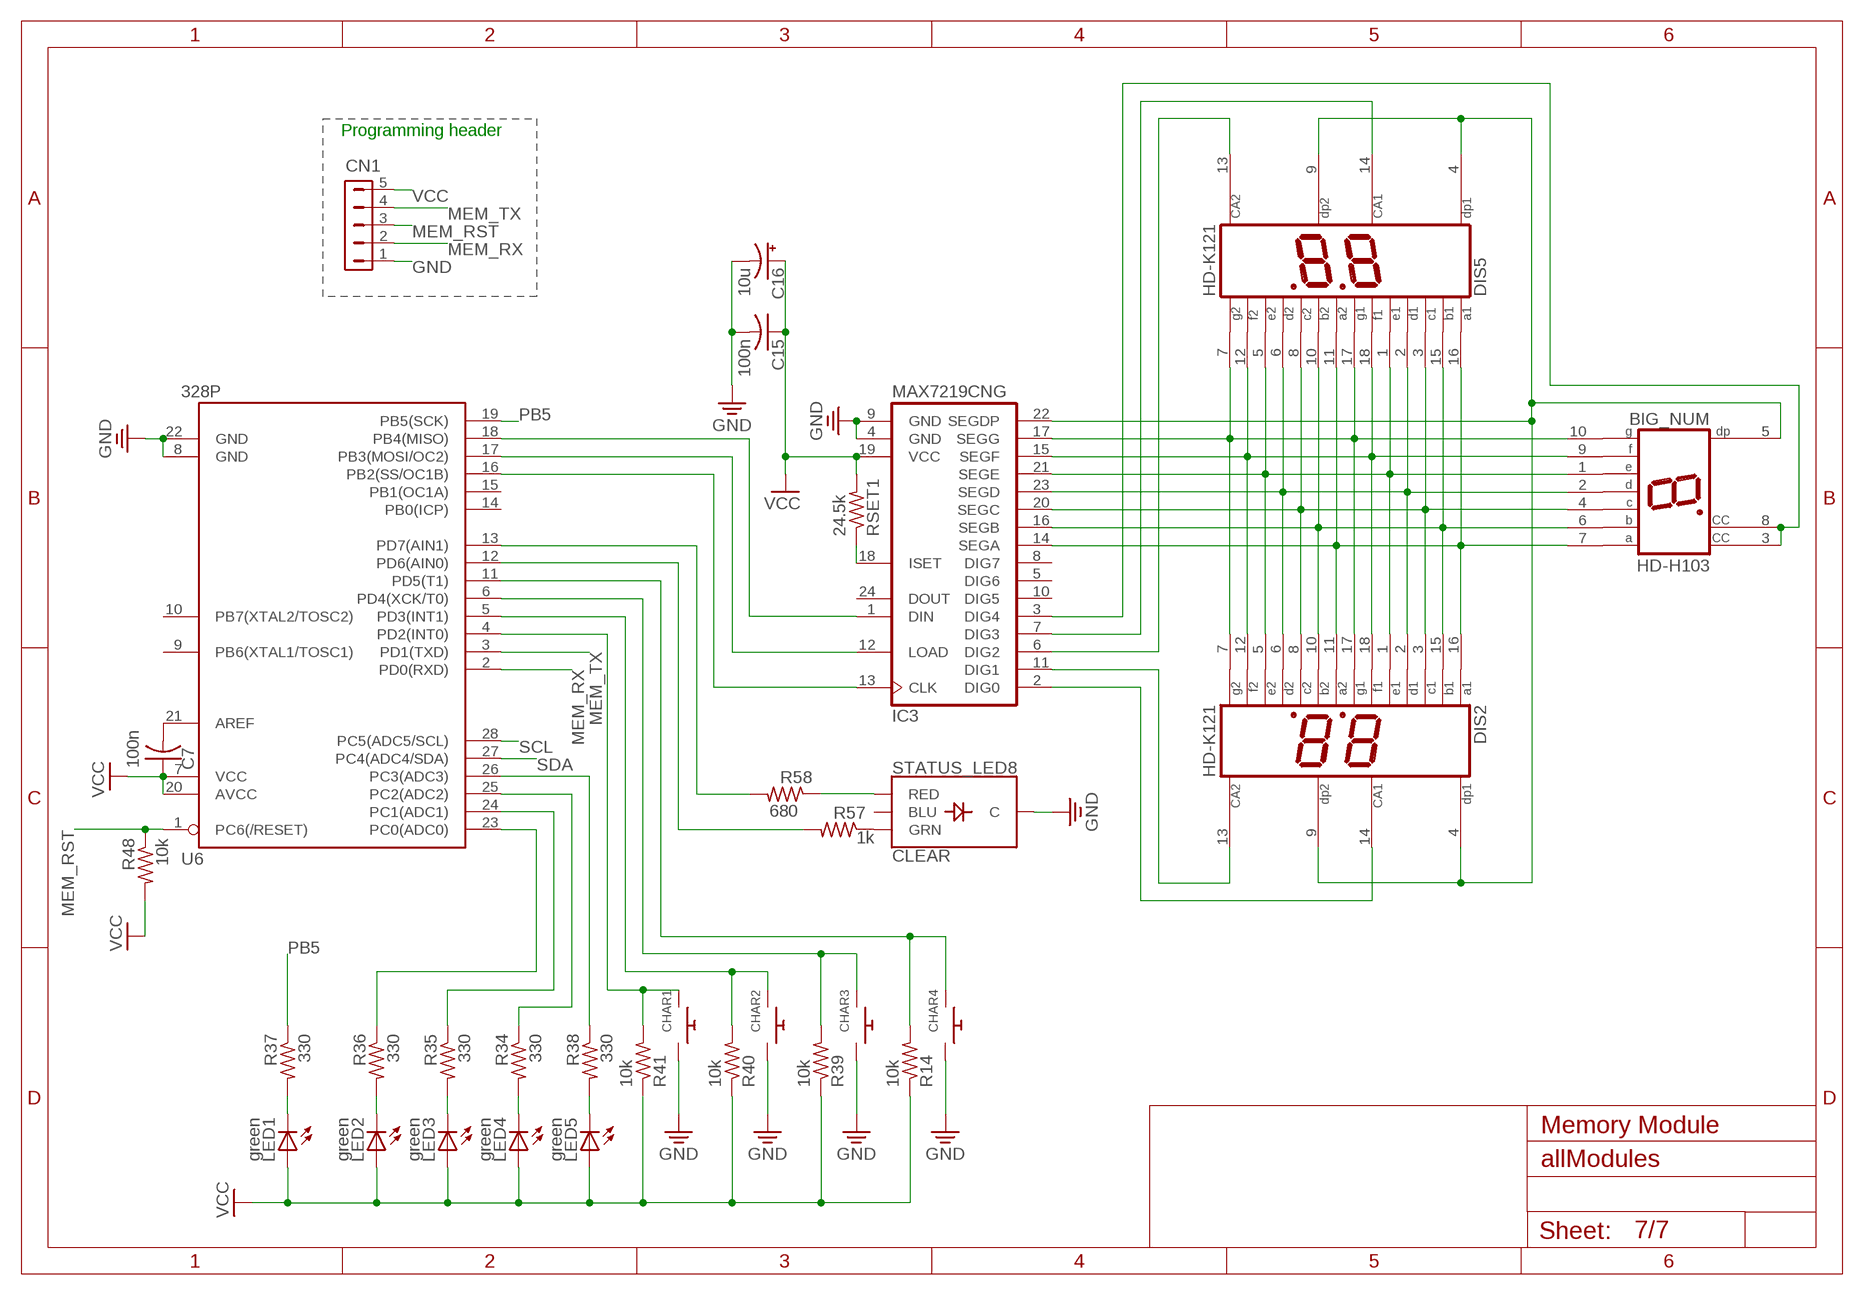
[diagram p6: schematic, sheet 7]

### Parts
BIG_NUM  HD-H103  [HDSP-M]
C7  100n  C-US025-024X044  [C025-024X044]
C15  100n  C-US025-024X044  [C025-024X044]
C16  10u  CPOL-US085CS-1AR  [085CS_1AR]
CHAR1  SWITCH_PUSHBUTTONEVQ-PE  [TACT_PANA-EVQ]
CHAR2  SWITCH_PUSHBUTTONEVQ-PE  [TACT_PANA-EVQ]
CHAR3  SWITCH_PUSHBUTTONEVQ-PE  [TACT_PANA-EVQ]
CHAR4  SWITCH_PUSHBUTTONEVQ-PE  [TACT_PANA-EVQ]
CN1  HDR-1X5-SIP-100  [SIP-100-5V]
DIS2  HD-K121  [HDSP-R]
DIS5  HD-K121  [HDSP-R]
IC3  MAX7219CNG  [DIL24-3]
LED1  green  LED5MM  [LED5MM]
LED2  green  LED5MM  [LED5MM]
LED3  green  LED5MM  [LED5MM]
LED4  green  LED5MM  [LED5MM]
LED5  green  LED5MM  [LED5MM]
R14  10k  R-US_0309/12  [0309/12]
R34  330  R-US_0309/12  [0309/12]
R35  330  R-US_0309/12  [0309/12]
R36  330  R-US_0309/12  [0309/12]
R37  330  R-US_0309/12  [0309/12]
R38  330  R-US_0309/12  [0309/12]
R39  10k  R-US_0309/12  [0309/12]
R40  10k  R-US_0309/12  [0309/12]
R41  10k  R-US_0309/12  [0309/12]
R48  10k  R-US_0309/12  [0309/12]
R57  1k  FLIPFLOP-RES  [0805-THM]
R58  680  FLIPFLOP-RES  [0805-THM]
RSET1  24.5k  R-US_0204/7  [0204/7]
STATUS_LED8  CLEAR  LED-RGB-CCCLEAR  [LED-RGB-THRU]
U6  328P  ATMEGA328P_PDIP  [DIP28]

### Nets
GND: C15.2 C16.- CHAR1.P$1 CHAR2.P$1 CHAR3.P$1 CHAR4.P$1 CN1.1 IC3.4(GND) IC3.9(GND) STATUS_LED8.2(C) U6.8(GND) U6.22(GND) ; also sheet 1,3,4,5,6
MEM_RST: CN1.3 R48.1 U6.1(PC6(/RESET))
MEM_RX: CN1.2 U6.2(PD0(RXD))
MEM_TX: CN1.4 U6.3(PD1(TXD))
N$91: BIG_NUM.7(A) DIS2.11(A2) DIS2.16(A1) DIS5.11(A2) DIS5.16(A1) IC3.14(SEGA)
N$92: BIG_NUM.6(B) DIS2.10(B2) DIS2.15(B1) DIS5.10(B2) DIS5.15(B1) IC3.16(SEGB)
N$93: BIG_NUM.4(C) DIS2.3(C1) DIS2.8(C2) DIS5.3(C1) DIS5.8(C2) IC3.20(SEGC)
N$94: BIG_NUM.2(D) DIS2.2(D1) DIS2.6(D2) DIS5.2(D1) DIS5.6(D2) IC3.23(SEGD)
N$95: BIG_NUM.1(E) DIS2.1(E1) DIS2.5(E2) DIS5.1(E1) DIS5.5(E2) IC3.21(SEGE)
N$96: BIG_NUM.9(F) DIS2.12(F2) DIS2.18(F1) DIS5.12(F2) DIS5.18(F1) IC3.15(SEGF)
N$97: BIG_NUM.10(G) DIS2.7(G2) DIS2.17(G1) DIS5.7(G2) DIS5.17(G1) IC3.17(SEGG)
N$98: BIG_NUM.5(DP) DIS2.4(DP1) DIS2.9(DP2) DIS5.4(DP1) DIS5.9(DP2) IC3.22(SEGDP)
N$99: R57.2 U6.12(PD6(AIN0))
N$100: R58.2 U6.13(PD7(AIN1))
N$101: DIS5.14(CA1) IC3.7(DIG3)
N$102: DIS5.13(CA2) IC3.6(DIG2)
N$103: DIS2.13(CA2) IC3.11(DIG1)
N$104: DIS2.14(CA1) IC3.2(DIG0)
N$105: LED1.K(C) R37.2
N$106: LED2.K(C) R36.2
N$107: C7.2 U6.21(AREF)
N$110: IC3.18(ISET) RSET1.1
N$111: LED3.K(C) R35.2
N$112: LED4.K(C) R34.2
N$113: LED5.K(C) R38.2
N$114: R35.1 R36.1 R38.1 U6.23(PC0(ADC0)) U6.24(PC1(ADC1)) U6.26(PC3(ADC3))
N$117: BIG_NUM.3(CC) BIG_NUM.8(CC) IC3.3(DIG4)
N$118: CHAR1.P$2 R41.2 U6.4(PD2(INT0))
N$119: IC3.13(CLK) U6.16(PB2(SS/OC1B))
N$120: CHAR3.P$2 R39.2 U6.6(PD4(XCK/T0))
N$121: CHAR4.P$2 R14.2 U6.11(PD5(T1))
N$134: R34.1 U6.25(PC2(ADC2))
N$135: IC3.12(LOAD) U6.17(PB3(MOSI/OC2))
N$136: CHAR2.P$2 R40.2 U6.5(PD3(INT1))
N$137: IC3.1(DIN) U6.18(PB4(MISO))
N$159: R57.1 STATUS_LED8.3(GRN)
N$160: R58.1 STATUS_LED8.1(RED)
PB5: R37.1 U6.19(PB5(SCK))
SCL: U6.28(PC5(ADC5/SCL)) ; also sheet 1,3,4,5,6
SDA: U6.27(PC4(ADC4/SDA)) ; also sheet 1,3,4,5,6
VCC: C7.1 C15.1 C16.+ CN1.5 IC3.19(VCC) LED1.A LED2.A LED3.A LED4.A LED5.A R14.1 R39.1 R40.1 R41.1 R48.2 RSET1.2 U6.7(VCC) U6.20(AVCC) ; also sheet 1,3,4,5,6
Unconnected: IC3.5(DIG6) IC3.8(DIG7) IC3.10(DIG5) IC3.24(DOUT) STATUS_LED8.4(BLU) U6.9(PB6(XTAL1/TOSC1)) U6.10(PB7(XTAL2/TOSC2)) U6.14(PB0(ICP)) U6.15(PB1(OC1A))

### Notes on the sheet
- Programming header
- Memory Module

## Library data of the parts
BAT1-BAT4 JP1-JP12 JP17-JP20 = adafruit:PINHD-1X1: Pin header 1x1 for 0.1" spacing With round pins
BIG_BTN CHAR1-CHAR4 DOWN_BTN LEFT_BTN RIGHT_BTN UP_BTN = adafruit:SWITCH_PUSHBUTTON: Buttons SOFTTOUCHSMD_SJ - Soft touch temporary push button (Super Junk Akihabara) Compatible with SKPMANE010 [Mouser: 688-SKPMAN] C&K_KSS = Digikey: KSS221GLFS
BIG_BTN_CHAR BIG_NUM DIGIT_1-DIGIT_4 = display-hp:HD-H103: LED DISPLAY 1-character 7 segment, decimal point right; OC_FARNELL: unknown; OC_NEWARK: unknown
BLU_BTN GRN_BTN RED_BTN YEL_BTN = adafruit:EG1218: SLIDING SWITCH 0.1" spacing through hole, vertical SPDT slide switch http://www.ladyada.net/library/pcb/eaglelibrary.html
BLUE BOB CAR CLEAR CLOCK_1 CLOCK_2 FRK FRQ GREEN IND LED1-LED6 LED11-LED45 NSA RED STRIKE_1 STRIKE_2 YELLOW = adafruit:LED: LED OSRAM: - CHIPLED LG R971, LG N971, LY N971, LG Q971, LY Q971, LO R971, LY R971 LH N974, LH R974 LS Q976, LO Q976, LY Q976 LO Q996 - Hyper CHIPLED LW Q18S LB Q993, LB Q99A, LB R99A - SideLED LS A670, LO A670, LY A670, LG A670, LP A670 LB A673, LV A673, LT A673, LW A673 LH A674 LY A675 LS A676, LA A676, LO A676, LY A676, LW A676 LS A679, LY A679, LG A679 - Hyper Micro SIDELED® LS Y876, LA Y876, LO Y876, LY Y876 LT Y87S - SmartLED LW L88C, LW L88S LB L89C, LB L89S, LG L890 LS L89K, LO L89K, LY L89K LS L896, LA L896, LO L896, LY L896 - TOPLED LS T670, LO T670, LY T670, LG T670, LP T670 LSG T670, LSP T670, LSY T670, LOP T670, LYG T670 LG T671, LOG T671, LSG T671 LB T673, LV T673, LT T673, LW T673 LH T674 LS T676, LA T676, LO T676, LY T676, LB T676, LH T676, LSB T676, LW T676 LB T67C, LV T67C, LT T67C, LS T67K, LO T67K, LY T67K, LW E67C LS E67B, LA E67B, LO E67B, LY E67B, LB E67C, LV E67C, LT E67C LW T67C LS T679, LY T679, LG T679 LS T770, LO T770, LY T770, LG T770, LP T770 LB T773, LV T773, LT T773, LW T773 LH T774 LS E675, LA E675, LY E675, LS T675 LS T776, LA T776, LO T776, LY T776, LB T776 LHGB T686 LT T68C, LB T68C - Hyper Mini TOPLED® LB M676 - Mini TOPLED Santana® LG M470 LS M47K, LO M47K, LY M47K Source: http://www.osram.convergy.de/
BUTTON_LED BUTTON_LED1-BUTTON_LED3 STATUS_LED2 STATUS_LED5-STATUS_LED8 STRIP_LED1-STRIP_LED3 = SparkFun-LED:LED-RGB-CC: LED-RGB Common Cathode Packages: LED RGB-THRU LED_PIRANHA_5MM SparkFun Products: RGB Diffused Common Cathode- Diffuse <[https://www.sparkfun.com/products/9264]> RGB Diffused Common Cathode - Clear <[https://www.sparkfun.com/products/105]> LED-RGB 5mm Square (Piranha) <[https://www.sparkfun.com/products/11679]>; PROD_ID: DIO-08418
BUZZER BUZZER1 = buzzer:EB2209A: BUZZER Source: Buerklin; OC_FARNELL: unknown; OC_NEWARK: unknown
C1 C3-C5 C7-C15 CSET = adafruit:C-US: CAPACITOR, American symbol
C2 C6 C16 = adafruit:CPOL-US: POLARIZED CAPACITOR, American symbol
CN1-CN5 CN8 = con-hdrs40:HDR-1X5: HEADER CONNECTOR
DIS2 DIS5 = display-hp:HD-K121: LED DISPLAY 2 x 1 character 7 segment, decimal points right; OC_FARNELL: unknown; OC_NEWARK: unknown
IC1-IC4 = maxim:MAX7219CNG: LED DISPLAY DRIVER; MF: MAXIM; MPN: MAX7219CNG; OC_FARNELL: 1523914; OC_NEWARK: 34C4018
IC5 = adafruit:MCP3008
IC6 = adafruit:MCP23017: http://ww1.microchip.com/downloads/en/DeviceDoc/21952a.pdf Source: http://ww1.microchip.com/downloads/en/DeviceDoc/21952a.pdf
MAX6954 = MAX6954:MAX6954
R1-R9 R14-R19 R32 R34-R49 = adafruit:R-US_: RESISTOR, American symbol
R10-R13 R30 R60 R61 RSET RSET1 RSET2 = BeagleBone_Black_Wireless:R-US_: RESISTOR, American symbol
R20-R29 R31 R33 R50-R59 = adafruit:FLIPFLOP-RES: Flip Flop resistor An 0805 resistor inside a standard 1/4W 5% resistor. Makes for easy mods
SERIAL_1-SERIAL_3 = MAX6954:XAMR14C2
U1-U6 = SparkFun-IC-Microcontroller:ATMEGA328P_PDIP: Atmel 328P Through hole ATMEGA328P uC used in the Arduino 32kb flash, 1k EEPROM, 2k SRAM Datasheet <http://www.sparkfun.com/datasheets/Components/SMD/ATMega328.pdf> SparkFun Products Storefront component: AVR 28 Pin 20MHz 32K 6A/D - ATMega328P <https://www.sparkfun.com/products/9061> (COM-09061) SparkFun Simon Says - Through-Hole Soldering Kit <https://www.sparkfun.com/products/10547> (KIT-10547) SparkFun Learn to Solder - Simon Says <https://www.sparkfun.com/products/13708> (KIT-13708) SparkFun BigTime Watch Kit <https://www.sparkfun.com/products/11734> (KIT-11734) SparkFun ClockIt <https://www.sparkfun.com/products/10930> (KIT-10930) SparkFun Serial Enabled LCD Kit <https://www.sparkfun.com/products/10097> (LCD-10097) SparkFun Simon Tilts - Through Hole Soldering Kit <https://www.sparkfun.com/products/12634> (KIT-12634) SparkFun Frequency Counter Kit <https://www.sparkfun.com/products/10140> (KIT-10140) FabFM Radio Kit <https://www.sparkfun.com/products/11043> (KIT-11043) SparkFun Binary Blaster Kit <https://www.sparkfun.com/products/12037> (KIT-12037) SparkFun Metro-Gnome <https://www.sparkfun.com/products/9236> (KIT-09236) ATmega328 with Arduino Optiboot (Uno) <https://www.sparkfun.com/products/10524> (DEV-10524); PROD_ID: IC-09136
U$2 = ESP12E_DEVKIT:ESP12E_DEVKIT: ESP12E DEVKIT BOARD